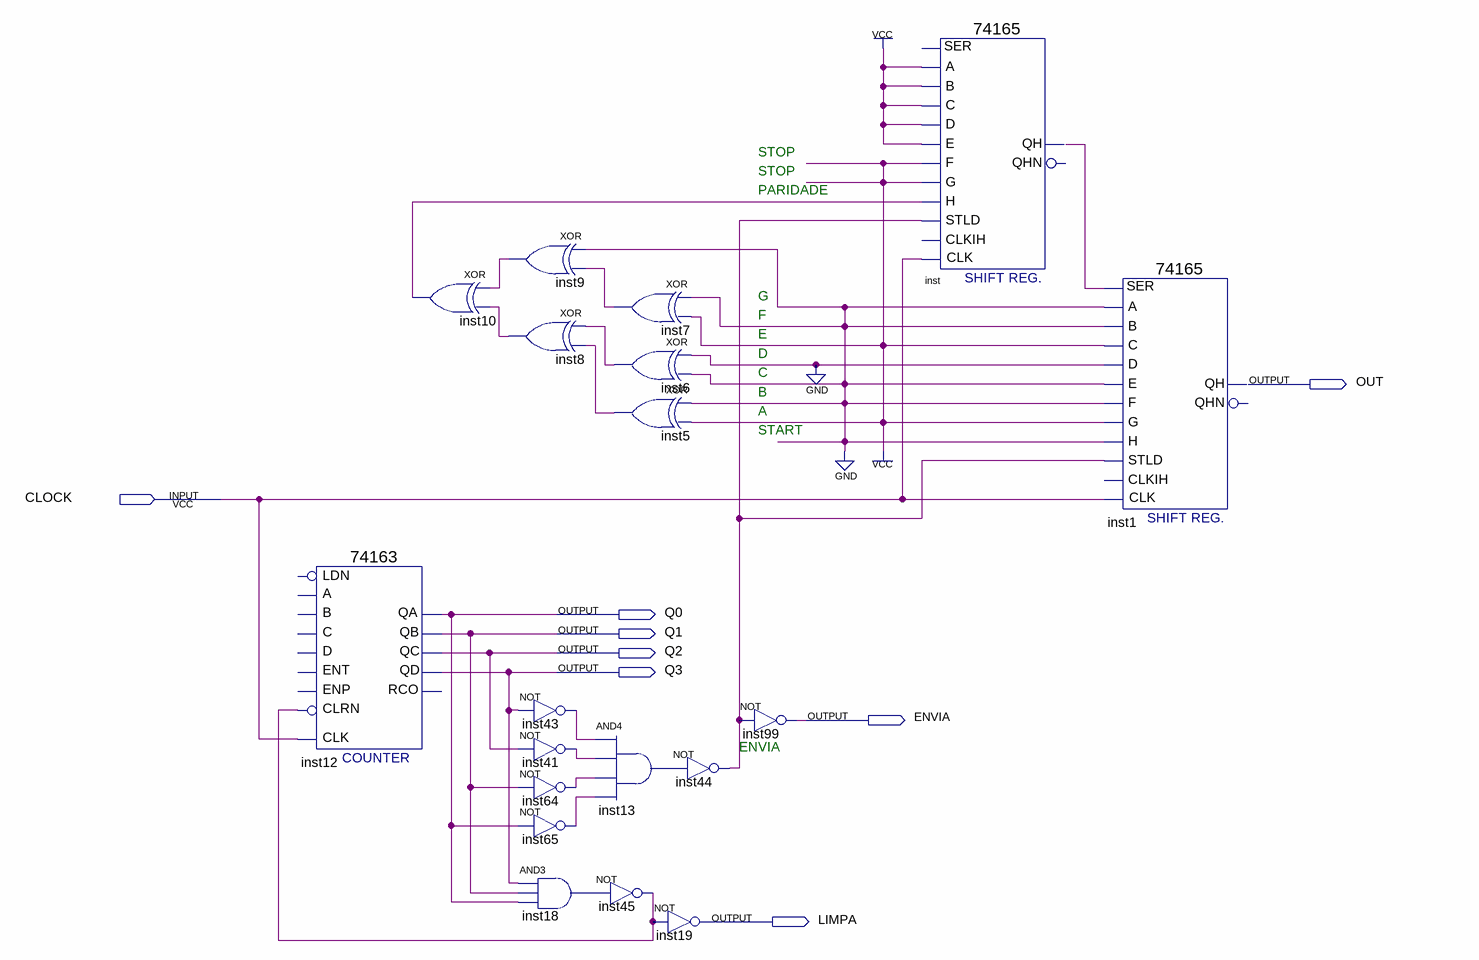
[diagram p0: schematic sheet]
// Quartus schematic P1_labdig.bdf as structural Verilog: 19 symbols, 8 pins
module P1_labdig (
  input  CLOCK,
  output OUT,
  output Q0,
  output Q1,
  output Q2,
  output Q3,
  output ENVIA,
  output LIMPA
);

  wire inst5_out, inst6_out, inst7_out, inst8_out, inst9_out, inst10_out, inst13_out, inst18_out, inst41_out,
       inst43_out, inst44_out, inst45_out, inst64_out, inst65_out, inst_qh;

  \74163  inst12 (
    .CLRN(inst45_out), .CLK(CLOCK), .QA(Q0), .QB(Q1), .QC(Q2), .QD(Q3));  // open: C, B, A, ENT, D, ENP, LDN, RCO
  xor inst10 (inst10_out, inst9_out, inst8_out);
  xor inst9 (inst9_out, 1'b0, inst7_out);
  xor inst8 (inst8_out, inst6_out, inst5_out);
  not inst43 (inst43_out, Q3);
  not inst41 (inst41_out, Q2);
  not inst64 (inst64_out, Q1);
  not inst65 (inst65_out, Q0);
  and inst18 (inst18_out, Q3, Q1, Q0);
  xor inst7 (inst7_out, 1'b0, 1'b1);
  xor inst6 (inst6_out, 1'b0, 1'b0);
  xor inst5 (inst5_out, 1'b0, 1'b1);
  and inst13 (inst13_out, inst43_out, inst41_out, inst64_out, inst65_out);
  not inst45 (inst45_out, inst18_out);
  not inst44 (inst44_out, inst13_out);
  not inst19 (LIMPA, inst45_out);
  not inst99 (ENVIA, inst44_out);
  \74165  inst (
    .D(1'b1), .C(1'b1), .B(1'b1), .G(1'b1), .H(inst10_out), .A(1'b1), .E(1'b1), .F(1'b1), .CLK(CLOCK),
    .STLD(inst44_out), .QH(inst_qh));  // open: CLKIH, SER, QHN
  \74165  inst1 (
    .D(1'b0), .C(1'b1), .B(1'b0), .G(1'b1), .H(1'b0), .A(1'b0), .E(1'b0), .F(1'b0), .CLK(CLOCK),
    .STLD(inst44_out), .SER(inst_qh), .QH(OUT));  // open: CLKIH, QHN

  // Notes on the sheet:
  //   STOP
  //   STOP
  //   PARIDADE
  //   G
  //   F
  //   E
  //   D
  //   C
  //   B
  //   A
  //   START
  //   ENVIA
endmodule
